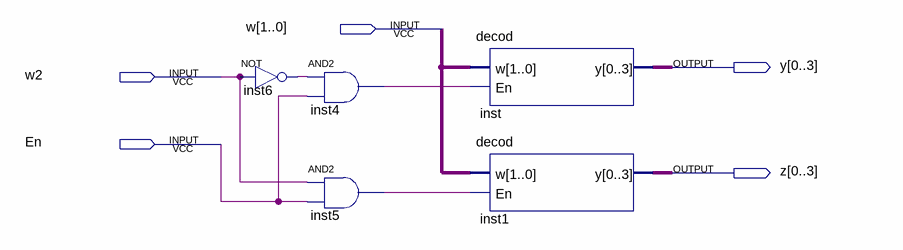
[diagram p0: schematic sheet]
// Quartus schematic decodModified.bdf as structural Verilog: 5 symbols, 5 pins
module decodModified (
  input  [1:0] w,
  input  w2,
  input  En,
  output [0:3] y,
  output [0:3] z
);

  wire inst4_out, inst5_out, inst6_out;

  not inst6 (inst6_out, w2);
  and inst4 (inst4_out, inst6_out, En);
  and inst5 (inst5_out, w2, En);
  decod inst (.w(w), .En(inst4_out), .y(y));
  decod inst1 (.w(w), .En(inst5_out), .y(z));
endmodule
